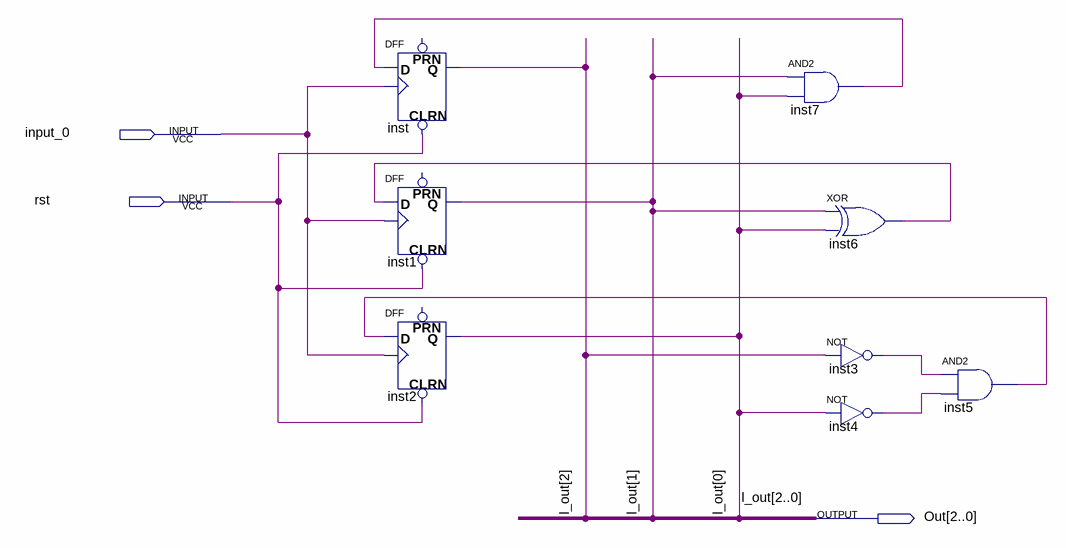
[diagram p0: schematic sheet]
// Quartus schematic count_5.bdf as structural Verilog: 8 symbols, 3 pins
module count_5 (
  input  input_0,
  input  rst,
  output [2:0] Out
);

  wire inst3_out, inst4_out, inst5_out, inst6_out, inst7_out;

  DFF inst (.CLRN(rst), .CLK(input_0), .D(inst7_out), .Q(Out[2]));  // open: PRN
  DFF inst1 (.CLRN(rst), .CLK(input_0), .D(inst6_out), .Q(Out[1]));  // open: PRN
  DFF inst2 (.CLRN(rst), .CLK(input_0), .D(inst5_out), .Q(Out[0]));  // open: PRN
  and inst7 (inst7_out, Out[1], Out[0]);
  xor inst6 (inst6_out, Out[1], Out[0]);
  not inst3 (inst3_out, Out[2]);
  not inst4 (inst4_out, Out[0]);
  and inst5 (inst5_out, inst3_out, inst4_out);

  // Other names for the same wires on the sheet: l_out[2:0] = Out
endmodule
